# EAGLE design module_adapter (EAGLE 5.12)
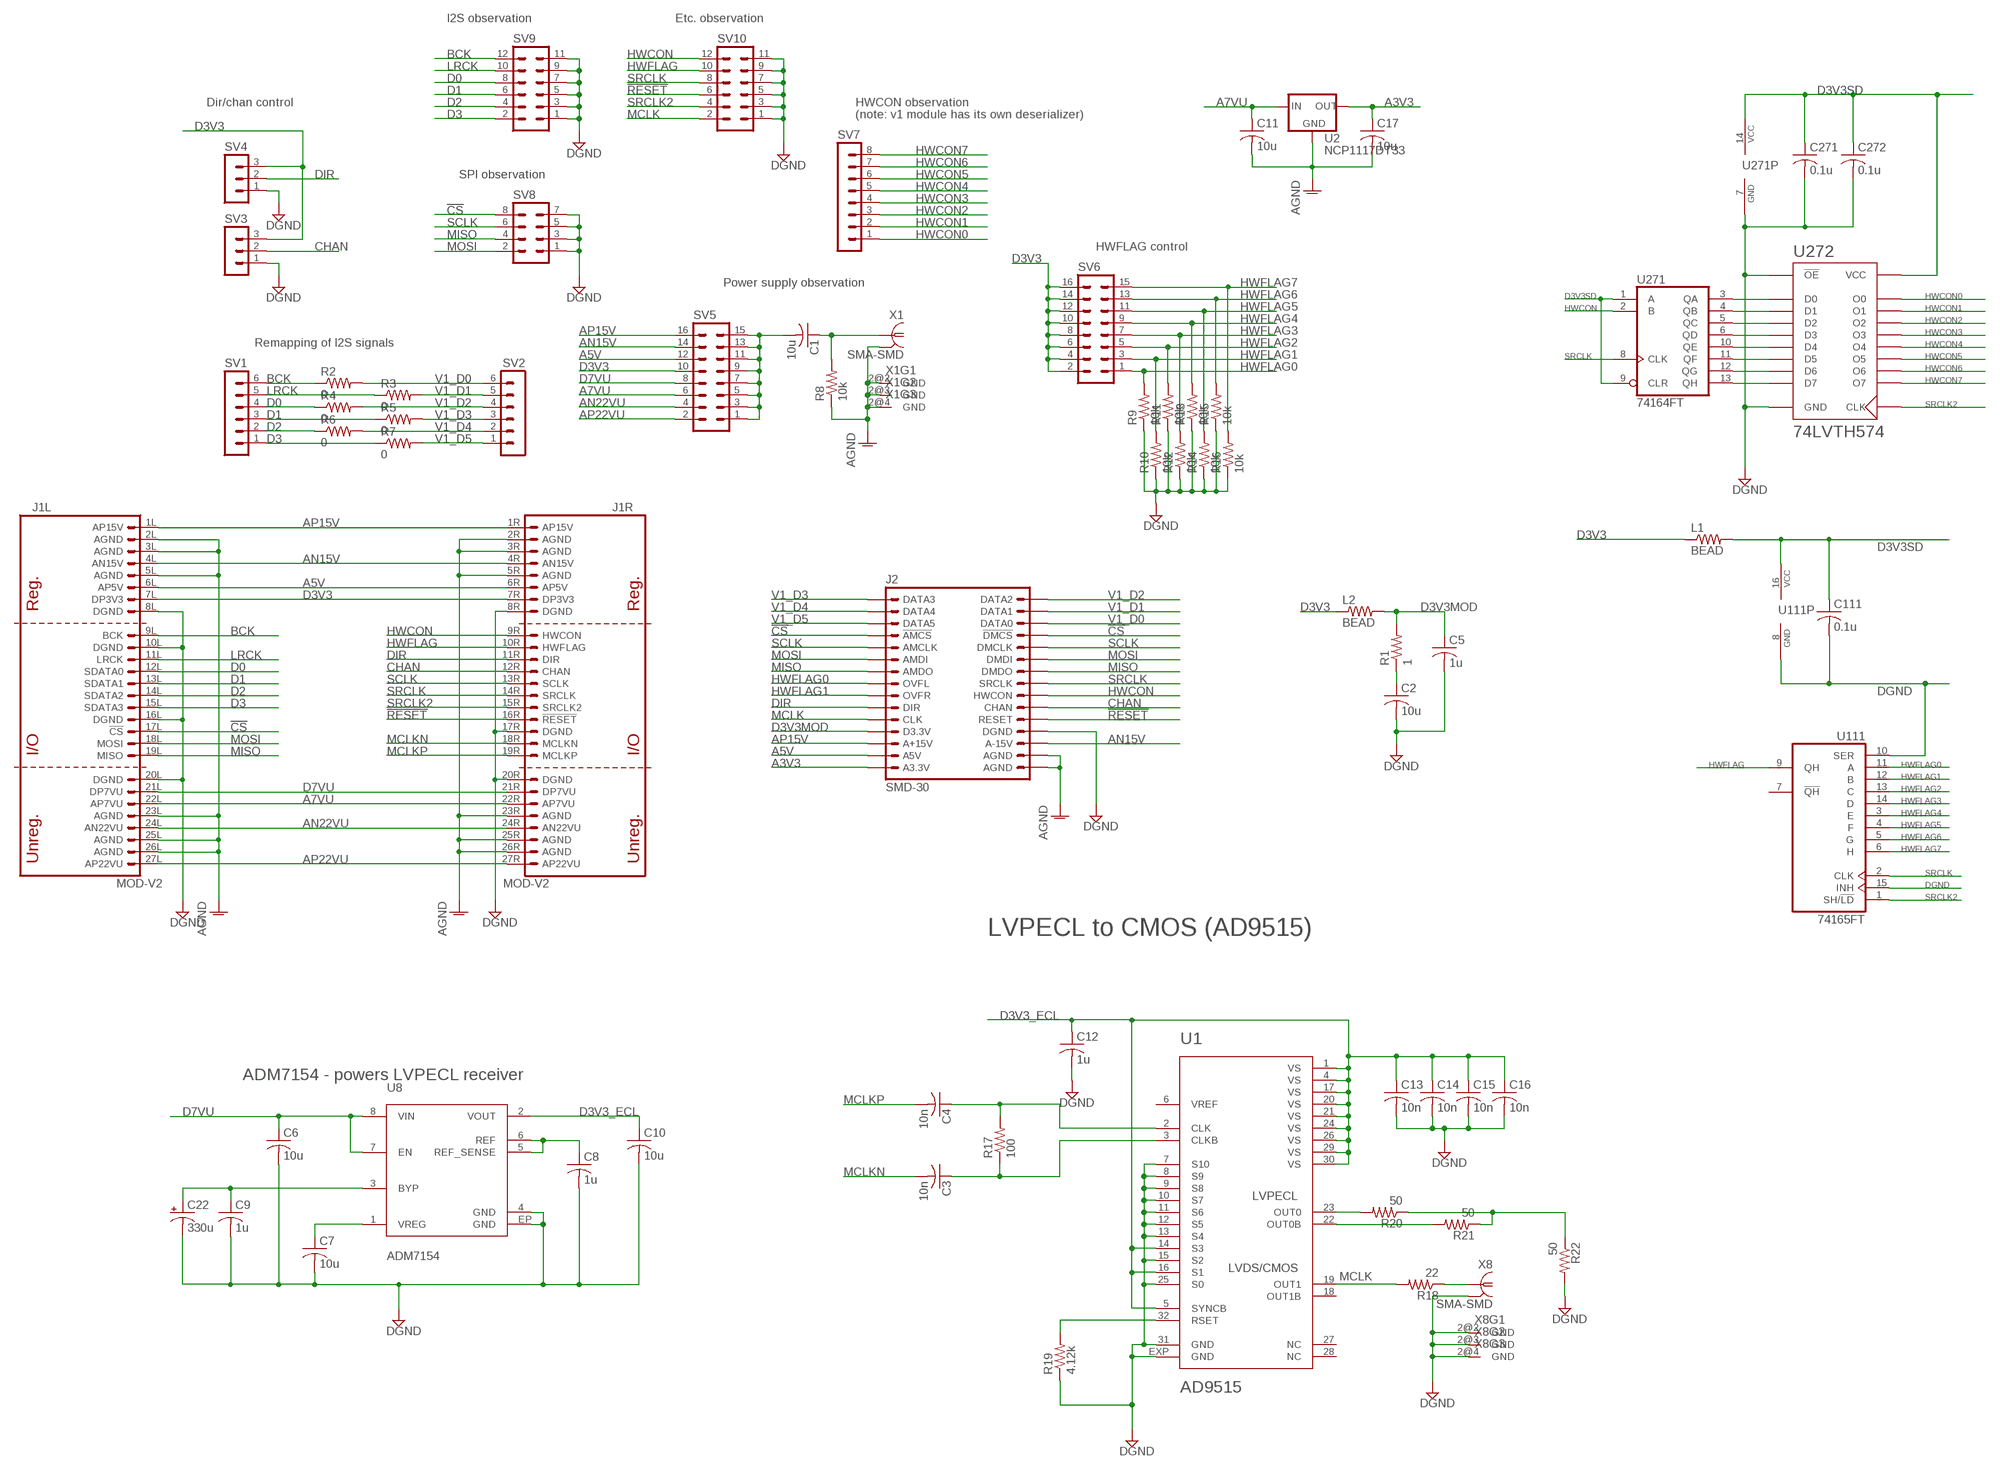
[diagram p0: schematic, sheet 1]

## Parts
C1  10u  C-USC1206  [C1206]
C2  10u  C-USC1206  [C1206]
C3  10n  C-USC0603  [C0603]
C4  10n  C-USC0603  [C0603]
C5  1u  C-USC0603  [C0603]
C6  10u  C-USC1206  [C1206]
C7  10u  C-USC1206  [C1206]
C8  1u  C-USC0805  [C0805]
C9  1u  C-USC0805  [C0805]
C10  10u  C-USC1206  [C1206]
C11  10u  C-USC1206  [C1206]
C12  1u  C-USC0805  [C0805]
C13  10n  C-USC0402  [C0402]
C14  10n  C-USC0402  [C0402]
C15  10n  C-USC0402  [C0402]
C16  10n  C-USC0402  [C0402]
C17  10u  C-USC1206  [C1206]
C22  330u  CPOL-USCT7343  [CT7343]
C111  0.1u  C-USC0603  [C0603]
C271  0.1u  C-USC0603  [C0603]
C272  0.1u  C-USC0603  [C0603]
J1  MOD-V2  [MOD-V2]
J2  SMD-30  [FCI-SMD-30]
L1  BEAD  R-US_R1206  [R1206]
L2  BEAD  R-US_R1206  [R1206]
R1  1  R-US_R0603  [R0603]
R2  0  R-US_R0603  [R0603]
R3  0  R-US_R0603  [R0603]
R4  0  R-US_R0603  [R0603]
R5  0  R-US_R0603  [R0603]
R6  0  R-US_R0603  [R0603]
R7  0  R-US_R0603  [R0603]
R8  10k  R-US_R0603  [R0603]
R9  10k  R-US_R0603  [R0603]
R10  10k  R-US_R0603  [R0603]
R11  10k  R-US_R0603  [R0603]
R12  10k  R-US_R0603  [R0603]
R13  10k  R-US_R0603  [R0603]
R14  10k  R-US_R0603  [R0603]
R15  10k  R-US_R0603  [R0603]
R16  10k  R-US_R0603  [R0603]
R17  100  R-US_R0603  [R0603]
R18  22  R-US_R0603  [R0603]
R19  4.12k  R-US_R0603  [R0603]
R20  50  R-US_R0603  [R0603]
R21  50  R-US_R0603  [R0603]
R22  50  R-US_R0603  [R0603]
SV1  MA06-1  [MA06-1]
SV2  MA06-1  [MA06-1]
SV3  MA03-1  [MA03-1]
SV4  MA03-1  [MA03-1]
SV5  MA08-2  [MA08-2]
SV6  MA08-2  [MA08-2]
SV7  MA08-1  [MA08-1]
SV8  MA04-2  [MA04-2]
SV9  MA06-2  [MA06-2]
SV10  MA06-2  [MA06-2]
U1  AD9515  [LFCSP32]
U2  NCP1117DT33  78XXS  [DPACK]
U8  ADM7154  [SO8-EP]
U111  74165FT  [TSSOP16]
U271  74164FT  [TSSOP14]
U272  74LVTH574  [TSSOP20]
X1  SMA-SMD  [SMA-SMD]
X8  SMA-SMD  [SMA-SMD]

## Nets
!CS: J1.17L(L:!CS) J2.12(!DMCS) J2.19(!AMCS) SV8.8
!RESET: J1.16R(R:!RESET) J2.5(RESET) SV10.6
A3V3: C17.1 J2.30(A3.3V) U2.3(OUT)
A5V: J1.6L(L:AP5V) J1.6R(R:AP5V) J2.29(A5V) SV5.12
A7VU: C11.1 J1.22L(L:AP7VU) J1.22R(R:AP7VU) SV5.6 U2.1(IN)
AGND: C11.2 C17.2 J1.2L(L:AGND) J1.2R(R:AGND) J1.3L(L:AGND) J1.3R(R:AGND) J1.5L(L:AGND) J1.5R(R:AGND) J1.23L(L:AGND) J1.23R(R:AGND) J1.25L(L:AGND) J1.25R(R:AGND) J1.26L(L:AGND) J1.26R(R:AGND) J2.1(AGND) J2.2(AGND) R8.1 U2.4(GND) X1.2@1(GND) X1.2@2(GND) X1.2@3(GND) X1.2@4(GND)
AN15V: J1.4L(L:AN15V) J1.4R(R:AN15V) J2.3(A-15V) SV5.14
AN22VU: J1.24L(L:AN22VU) J1.24R(R:AN22VU) SV5.4
AP15V: J1.1L(L:AP15V) J1.1R(R:AP15V) J2.28(A+15V) SV5.16
AP22VU: J1.27L(L:AP22VU) J1.27R(R:AP22VU) SV5.2
BCK: J1.9L(L:BCK) R2.1 SV1.6 SV9.12
CHAN: J1.12R(R:CHAN) J2.6(CHAN) SV3.2
D0: J1.12L(L:SDATA0) R4.1 SV1.4 SV9.8
D1: J1.13L(L:SDATA1) R5.1 SV1.3 SV9.6
D2: J1.14L(L:SDATA2) R6.1 SV1.2 SV9.4
D3: J1.15L(L:SDATA3) R7.1 SV1.1 SV9.2
D3V3: J1.7L(L:DP3V3) J1.7R(R:DP3V3) L1.1 L2.1 SV3.3 SV4.3 SV5.10 SV6.2 SV6.4 SV6.6 SV6.8 SV6.10 SV6.12 SV6.14 SV6.16
D3V3_ECL: C10.1 C12.1 C13.1 C14.1 C15.1 C16.1 U1.1(VS) U1.4(VS) U1.5(SYNCB) U1.14(S3) U1.16(S1) U1.17(VS) U1.20(VS) U1.21(VS) U1.24(VS) U1.26(VS) U1.29(VS) U1.30(VS) U8.2(VOUT)
D3V3MOD: C5.1 J2.27(D3.3V) L2.2 R1.2
D3V3SD [power]: C111.1 C271.1 C272.1 L1.2 U111.16(VCC) U271.1(A) U271.9(CLR) U271.14(VCC) U272.20(VCC)
D7VU: C6.1 J1.21L(L:DP7VU) J1.21R(R:DP7VU) SV5.8 U8.7(EN) U8.8(VIN)
DGND: C2.2 C5.2 C6.2 C7.2 C8.2 C9.2 C10.2 C12.2 C13.2 C14.2 C15.2 C16.2 C22.- C111.2 C271.2 C272.2 J1.8L(L:DGND) J1.8R(R:DGND) J1.10L(L:DGND) J1.16L(L:DGND) J1.17R(R:DGND) J1.20L(L:DGND) J1.20R(R:DGND) J2.4(DGND) R9.1 R10.1 R11.1 R12.1 R13.1 R14.1 R15.1 R16.1 R19.1 R22.2 SV3.1 SV4.1 SV8.1 SV8.3 SV8.5 SV8.7 SV9.1 SV9.3 SV9.5 SV9.7 SV9.9 SV9.11 SV10.1 SV10.3 SV10.5 SV10.7 SV10.9 SV10.11 U1.7(S10) U1.8(S9) U1.9(S8) U1.10(S7) U1.11(S6) U1.12(S5) U1.13(S4) U1.15(S2) U1.25(S0) U1.31(GND) U1.EXP(GND) U8.4(GND) U8.EP(GND) U111.8(GND) U111.10(SER) U111.15(INH) U271.7(GND) U272.1(!OE) U272.10(GND) X8.2@1(GND) X8.2@2(GND) X8.2@3(GND) X8.2@4(GND)
DIR: J1.11R(R:DIR) J2.25(DIR) SV4.2
HWCON: J1.9R(R:HWCON) J2.7(HWCON) SV10.12 U271.2(B)
HWCON0: SV7.1 U272.19(O0)
HWCON1: SV7.2 U272.18(O1)
HWCON2: SV7.3 U272.17(O2)
HWCON3: SV7.4 U272.16(O3)
HWCON4: SV7.5 U272.15(O4)
HWCON5: SV7.6 U272.14(O5)
HWCON6: SV7.7 U272.13(O6)
HWCON7: SV7.8 U272.12(O7)
HWFLAG: J1.10R(R:HWFLAG) SV10.10 U111.9(QH)
HWFLAG0: J2.23(OVFL) R9.2 SV6.1 U111.11(A)
HWFLAG1: J2.24(OVFR) R10.2 SV6.3 U111.12(B)
HWFLAG2: R11.2 SV6.5 U111.13(C)
HWFLAG3: R12.2 SV6.7 U111.14(D)
HWFLAG4: R13.2 SV6.9 U111.3(E)
HWFLAG5: R14.2 SV6.11 U111.4(F)
HWFLAG6: R15.2 SV6.13 U111.5(G)
HWFLAG7: R16.2 SV6.15 U111.6(H)
LRCK: J1.11L(L:LRCK) R3.1 SV1.5 SV9.10
MCLK: J2.26(CLK) R18.2 SV10.2 U1.19(OUT1)
MCLKN: C3.2 J1.18R(R:MCLKN)
MCLKP: C4.2 J1.19R(R:MCLKP)
MISO: J1.19L(L:MISO) J2.9(DMDO) J2.22(AMDO) SV8.4
MOSI: J1.18L(L:MOSI) J2.10(DMDI) J2.21(AMDI) SV8.2
N$1: C4.1 R17.2 U1.2(CLK)
N$2: U271.4(QB) U272.3(D1)
N$3: U271.5(QC) U272.4(D2)
N$4: U271.10(QE) U272.6(D4)
N$5: U271.11(QF) U272.7(D5)
N$6: U271.12(QG) U272.8(D6)
N$7: U271.13(QH) U272.9(D7)
N$10: C2.1 R1.1
N$11: R20.2 U1.23(OUT0)
N$13: C1.2 SV5.1 SV5.3 SV5.5 SV5.7 SV5.9 SV5.11 SV5.13 SV5.15
N$14: C1.1 R8.2 X1.1
N$15: C3.1 R17.1 U1.3(CLKB)
N$19: C7.1 U8.1(VREG)
N$21: U271.3(QA) U272.2(D0)
N$23: R18.1 X8.1
N$24: U271.6(QD) U272.5(D3)
N$25: R21.2 U1.22(OUT0B)
N$26: C9.1 C22.+ U8.3(BYP)
N$27: R19.2 U1.32(RSET)
N$28: C8.1 U8.5(REF_SENSE) U8.6(REF)
N$29: R20.1 R21.1 R22.1
SCLK: J1.13R(R:SCLK) J2.11(DMCLK) J2.20(AMCLK) SV8.6
SRCLK: J1.14R(R:SRCLK) J2.8(SRCLK) SV10.8 U111.2(CLK) U271.8(CLK)
SRCLK2: J1.15R(R:SRCLK2) SV10.4 U111.1(SH/!LD) U272.11(CLK)
V1_D0: J2.13(DATA0) R2.2 SV2.6
V1_D1: J2.14(DATA1) R3.2 SV2.5
V1_D2: J2.15(DATA2) R4.2 SV2.4
V1_D3: J2.16(DATA3) R5.2 SV2.3
V1_D4: J2.17(DATA4) R6.2 SV2.2
V1_D5: J2.18(DATA5) R7.2 SV2.1
Unconnected: U1.6(VREF) U1.18(OUT1B) U1.27(NC) U1.28(NC) U111.7(!QH)

## Notes on the sheet
- I2S observation | Etc. observation
- Dir/chan control | HWCON observation
- (note: v1 module has its own deserializer)
- SPI observation
- HWFLAG control
- Power supply observation
- Remapping of I2S signals
- LVPECL to CMOS (AD9515)
- ADM7154 - powers LVPECL receiver

## Library data of the parts
C1-C17 C111 C271 C272 = rcl:C-US: CAPACITOR, American symbol
C22 = rcl:CPOL-US: POLARIZED CAPACITOR, American symbol
J1 = cdp:MOD-V2
J2 = cdp:SMD-30
L1 L2 R1-R22 = rcl:R-US_: RESISTOR, American symbol
SV1 SV2 = con-lstb:MA06-1: PIN HEADER; OC_FARNELL: unknown; OC_NEWARK: unknown
SV3 SV4 = con-lstb:MA03-1: PIN HEADER; OC_FARNELL: unknown; OC_NEWARK: unknown
SV5 SV6 = con-lstb:MA08-2: PIN HEADER; OC_FARNELL: unknown; OC_NEWARK: unknown
SV7 = con-lstb:MA08-1: PIN HEADER; OC_FARNELL: unknown; OC_NEWARK: unknown
SV8 = con-lstb:MA04-2: PIN HEADER; OC_FARNELL: unknown; OC_NEWARK: unknown
SV9 SV10 = con-lstb:MA06-2: PIN HEADER; OC_FARNELL: unknown; OC_NEWARK: unknown
U1 = cdp:AD9515
U2 = cdp:78XXS: VOLTAGE REGULATOR
U8 = cdp:ADM7154
U111 = cdp:74*165: 8-bit parallel load SHIFT REGISTER
U271 = cdp:74*164: 8-bit parallel out SHIFT REGISTER
U272 = cdp:74LVTH574
X1 X8 = cdp:SMA-SMD: SMA 50 Ohm Straight Jack Receptacle - Surface Mount www.johnsoncomponents.com Source: http://catalog.digikey.com .. 142-0711-201, 205, 202, 206.pdf; OC_FARNELL: unknown; OC_NEWARK: unknown

## Board
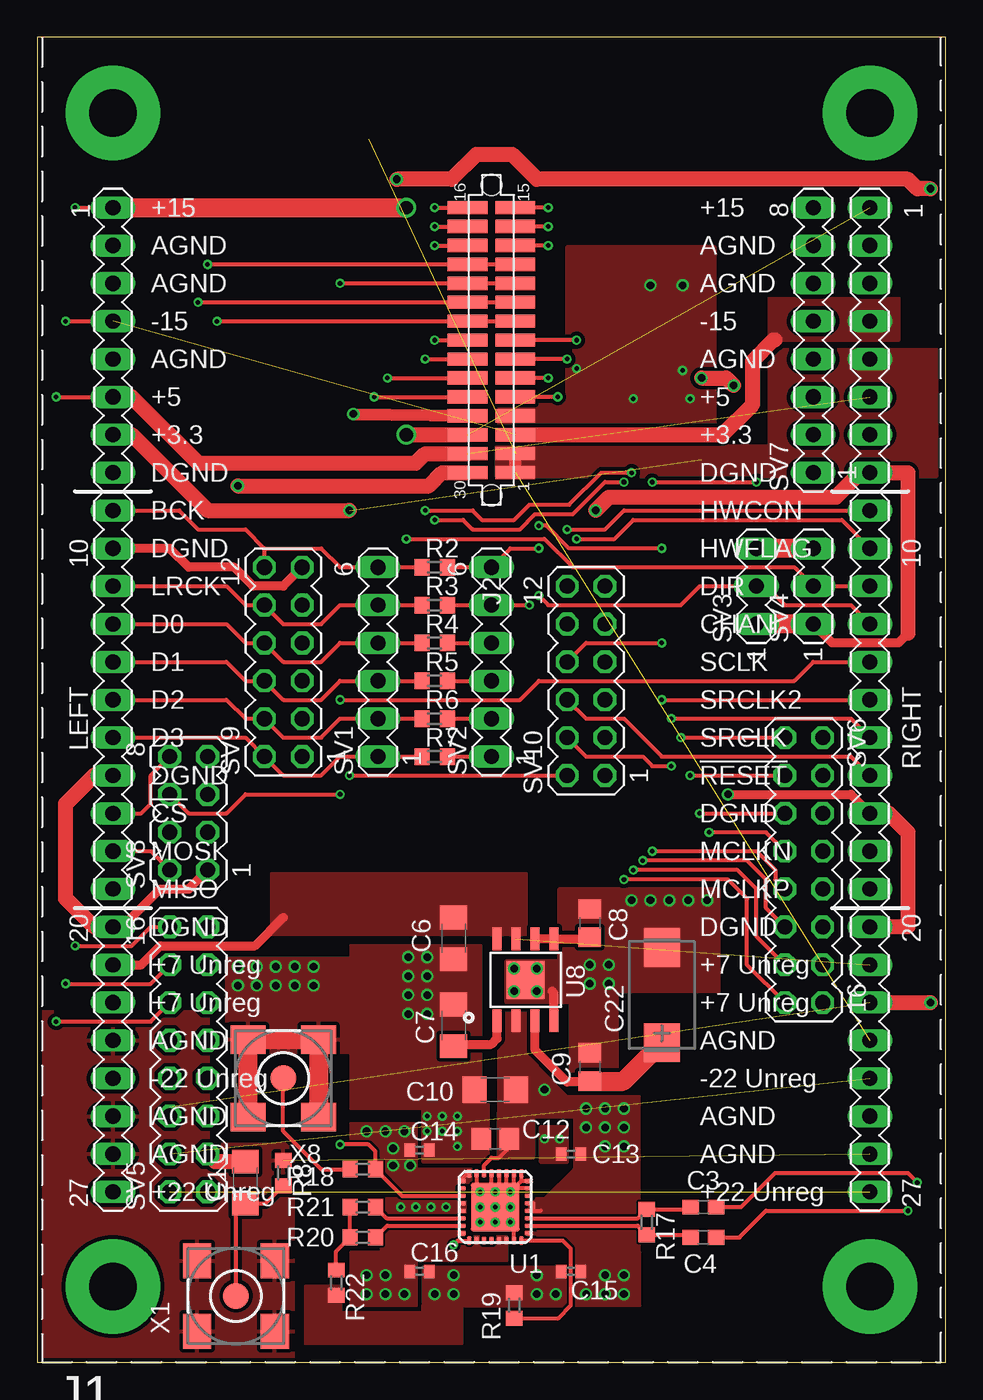
[diagram p1: board, top side]
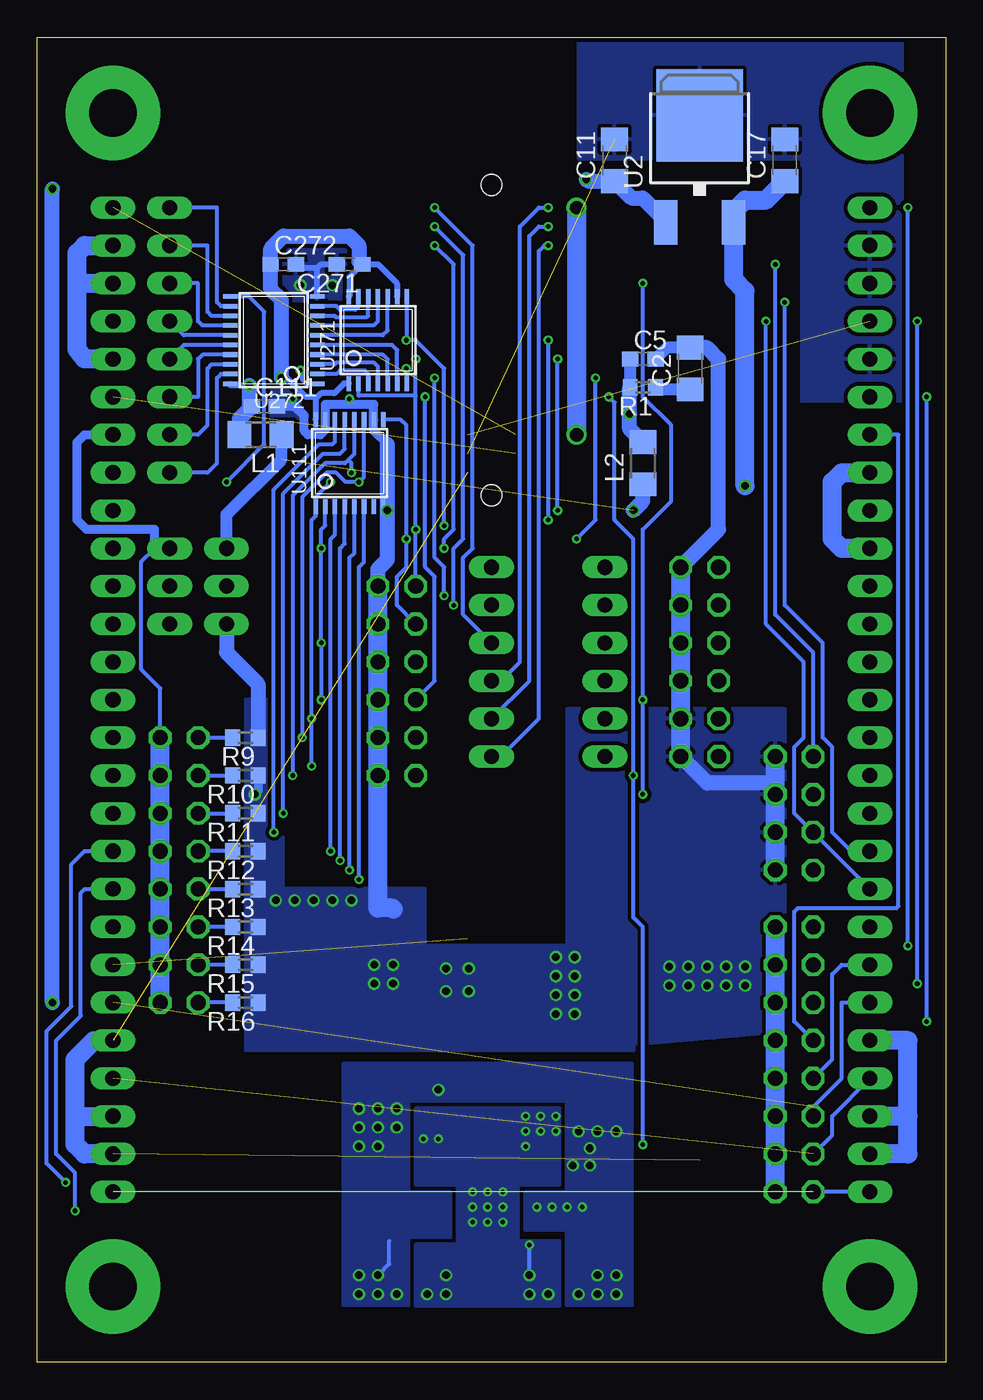
[diagram p2: board, bottom side, seen from below]

Size 60.96 x 88.9 mm. Coordinates in mm from the lower left corner, seen from the top.
Outline: 0,0 60.96,0 60.96,88.9 0,88.9 0,0
Copper layers (1*16): Top 0.035mm / dielectric 1.6mm / Bottom 0.035mm
Design rules "Elecrow_2-layer_PCB_eagle_rule_mod": minimum track width 6mil, minimum drill 12mil, track to track 6mil, track to pad 6mil, pad to pad 6mil, via to via 8mil, smd to smd 0mil, copper to edge 12mil, drill to drill 10mil, minimum pad ring 6mil, minimum via ring 6mil, stop-mask expansion 0mil, vias tented up to drill 100mil, thermal gap 10mil

### Footprints (pad centres in the part's own frame; a part is rotated, then mirrored left to right if it is on the bottom)
C1206 = smd 1.6 x 1.8: 1 -1.4,0; 2 1.4,0
C0603 = smd 1.1 x 1: 1 -0.85,0; 2 0.85,0
C0805 = smd 1.3 x 1.5: 1 -0.95,0; 2 0.95,0
C0402 = smd 0.7 x 0.9: 1 -0.65,0; 2 0.65,0
CT7343 = smd 2.6 x 2.4: + -3.2,0; - 3.2,0
MOD-V2 = drill 1.016 long: 1L -25.4,33.02; 1R 25.4,33.02; 2L -25.4,30.48; 2R 25.4,30.48; 3L -25.4,27.94; 3R 25.4,27.94; 4L -25.4,25.4; 4R 25.4,25.4; 5L -25.4,22.86; 5R 25.4,22.86; 6L -25.4,20.32; 6R 25.4,20.32; 7L -25.4,17.78; 7R 25.4,17.78; 8L -25.4,15.24; 8R 25.4,15.24; 9L -25.4,12.7; 9R 25.4,12.7; 10L -25.4,10.16; 10R 25.4,10.16; 11L -25.4,7.62; 11R 25.4,7.62; 12L -25.4,5.08; 12R 25.4,5.08; 13L -25.4,2.54; 13R 25.4,2.54; 14L -25.4,0; 14R 25.4,0; 15L -25.4,-2.54; 15R 25.4,-2.54; 16L -25.4,-5.08; 16R 25.4,-5.08; 17L -25.4,-7.62; 17R 25.4,-7.62; 18L -25.4,-10.16; 18R 25.4,-10.16; 19L -25.4,-12.7; 19R 25.4,-12.7; 20L -25.4,-15.24; 20R 25.4,-15.24; 21L -25.4,-17.78; 21R 25.4,-17.78; 22L -25.4,-20.32; 22R 25.4,-20.32; 23L -25.4,-22.86; 23R 25.4,-22.86; 24L -25.4,-25.4; 24R 25.4,-25.4; 25L -25.4,-27.94; 25R 25.4,-27.94; 26L -25.4,-30.48; 26R 25.4,-30.48; 27L -25.4,-33.02; 27R 25.4,-33.02 | drill 3.175 pad 6.35 round: DP1 -25.4,39.37; DP2 25.4,39.37; DP3 -25.4,-39.37; DP4 25.4,-39.37
FCI-SMD-30 = smd 0.889 x 2.667: 1 -8.89,-1.6; 2 -7.62,-1.6; 3 -6.35,-1.6; 4 -5.08,-1.6; 5 -3.81,-1.6; 6 -2.54,-1.6; 7 -1.27,-1.6; 8 0,-1.6; 9 1.27,-1.6; 10 2.54,-1.6; 11 3.81,-1.6; 12 5.08,-1.6; 13 6.35,-1.6; 14 7.62,-1.6; 15 8.89,-1.6; 16 8.89,1.6; 17 7.62,1.6; 18 6.35,1.6; 19 5.08,1.6; 20 3.81,1.6; 21 2.54,1.6; 22 1.27,1.6; 23 0,1.6; 24 -1.27,1.6; 25 -2.54,1.6; 26 -3.81,1.6; 27 -5.08,1.6; 28 -6.35,1.6; 29 -7.62,1.6; 30 -8.89,1.6 | hole 1.4: -10.414,0; 10.414,0
R1206 = smd 1.6 x 1.803: 1 -1.422,0; 2 1.422,0
R0603 = smd 1 x 1.1: 1 -0.85,0; 2 0.85,0
MA06-1 = drill 1.016 long: 1 -6.35,0; 2 -3.81,0; 3 -1.27,0; 4 1.27,0; 5 3.81,0; 6 6.35,0
MA03-1 = drill 1.016 long: 1 -2.54,0; 2 0,0; 3 2.54,0
MA08-2 = drill 1.016 octagon: 1 -8.89,-1.27; 2 -8.89,1.27; 3 -6.35,-1.27; 4 -6.35,1.27; 5 -3.81,-1.27; 6 -3.81,1.27; 7 -1.27,-1.27; 8 -1.27,1.27; 9 1.27,-1.27; 10 1.27,1.27; 11 3.81,-1.27; 12 3.81,1.27; 13 6.35,-1.27; 14 6.35,1.27; 15 8.89,-1.27; 16 8.89,1.27
MA08-1 = drill 1.016 long: 1 -8.89,0; 2 -6.35,0; 3 -3.81,0; 4 -1.27,0; 5 1.27,0; 6 3.81,0; 7 6.35,0; 8 8.89,0
MA04-2 = drill 1.016 octagon: 1 -3.81,-1.27; 2 -3.81,1.27; 3 -1.27,-1.27; 4 -1.27,1.27; 5 1.27,-1.27; 6 1.27,1.27; 7 3.81,-1.27; 8 3.81,1.27
MA06-2 = drill 1.016 octagon: 1 -6.35,-1.27; 2 -6.35,1.27; 3 -3.81,-1.27; 4 -3.81,1.27; 5 -1.27,-1.27; 6 -1.27,1.27; 7 1.27,-1.27; 8 1.27,1.27; 9 3.81,-1.27; 10 3.81,1.27; 11 6.35,-1.27; 12 6.35,1.27
LFCSP32 = smd 0.55 x 0.3: 1 -2.25,1.75; 2 -2.25,1.25; 3 -2.25,0.75; 4 -2.25,0.25; 5 -2.25,-0.25; 6 -2.25,-0.75; 7 -2.25,-1.25; 8 -2.25,-1.75; 17 2.25,-1.75; 18 2.25,-1.25; 19 2.25,-0.75; 20 2.25,-0.25; 21 2.25,0.25; 22 2.25,0.75; 23 2.25,1.25; 24 2.25,1.75 | smd 0.3 x 0.55: 9 -1.75,-2.25; 10 -1.25,-2.25; 11 -0.75,-2.25; 12 -0.25,-2.25; 13 0.25,-2.25; 14 0.75,-2.25; 15 1.25,-2.25; 16 1.75,-2.25; 25 1.75,2.25; 26 1.25,2.25; 27 0.75,2.25; 28 0.25,2.25; 29 -0.25,2.25; 30 -0.75,2.25; 31 -1.25,2.25; 32 -1.75,2.25 | smd 3.25 x 3.25: EXP 0,0
DPACK = smd 1.6 x 3: 1 -2.28,-4.8; 3 2.28,-4.8 | smd 5.8 x 6.2: 4 0,2.38
SO8-EP = smd 0.61 x 1.524: 1 -1.905,-2.743; 2 -0.635,-2.743; 3 0.635,-2.743; 4 1.905,-2.743; 5 1.905,2.743; 6 0.635,2.743; 7 -0.635,2.743; 8 -1.905,2.743 | smd 2.54 x 2.54: EP 0,0
TSSOP16 = smd 0.305 x 0.991: 1 -2.275,-2.918; 2 -1.625,-2.918; 3 -0.975,-2.918; 4 -0.325,-2.918; 5 0.325,-2.918; 6 0.975,-2.918; 7 1.625,-2.918; 8 2.275,-2.918; 9 2.275,2.918; 10 1.625,2.918; 11 0.975,2.918; 12 0.325,2.918; 13 -0.325,2.918; 14 -0.975,2.918; 15 -1.625,2.918; 16 -2.275,2.918
TSSOP14 = smd 0.305 x 0.991: 1 -1.95,-2.918; 2 -1.3,-2.918; 3 -0.65,-2.918; 4 0,-2.918; 5 0.65,-2.918; 6 1.3,-2.918; 7 1.95,-2.918; 8 1.95,2.918; 9 1.3,2.918; 10 0.65,2.918; 11 0,2.918; 12 -0.65,2.918; 13 -1.3,2.918; 14 -1.95,2.918
TSSOP20 = smd 0.305 x 0.991: 1 -2.925,-2.918; 2 -2.275,-2.918; 3 -1.625,-2.918; 4 -0.975,-2.918; 5 -0.325,-2.918; 6 0.325,-2.918; 7 0.975,-2.918; 8 1.625,-2.918; 9 2.275,-2.918; 10 2.925,-2.918; 11 2.925,2.918; 12 2.275,2.918; 13 1.625,2.918; 14 0.975,2.918; 15 0.325,2.918; 16 -0.325,2.918; 17 -0.975,2.918; 18 -1.625,2.918; 19 -2.275,2.918; 20 -2.925,2.918
SMA-SMD = smd 1.73 x 1.73: 1 0,0 | smd 2.35 x 1.9: 2@1 -2.375,2.6; 2@2 -2.375,-2.6; 2@3 2.375,-2.6; 2@4 2.375,2.6

### Placement (x,y rotation side)
C1  13.97,12.06 90 top
C2  17.14,66.67 90 bottom
C3  44.7,10.41 0 top
C4  44.7,8.38 0 top
C5  20.32,67.31 0 bottom
C6  27.94,28.45 270 top
C7  27.94,22.61 90 top
C8  37.08,29.46 90 top
C9  37.08,19.81 90 top
C10  30.73,18.29 180 top
C11  22.23,80.64 90 bottom
C12  30.73,14.99 180 top
C13  35.81,13.97 180 top
C14  25.65,14.22 0 top
C15  35.81,6.1 180 top
C16  25.65,6.1 0 top
C17  10.79,80.64 90 bottom
C22  41.91,24.64 90 top
C111  45.72,64.14 0 bottom
C271  40.01,73.66 180 bottom
C272  44.45,73.66 0 bottom
J1  30.48,44.45 0 top
J2  30.48,68.58 90 top
L1  45.97,62.23 180 bottom
L2  20.32,60.33 90 bottom
R1  20.32,65.41 180 bottom
R2  26.67,53.34 0 top
R3  26.67,50.8 0 top
R4  26.67,48.26 0 top
R5  26.67,45.72 0 top
R6  26.67,43.18 0 top
R7  26.67,40.64 0 top
R8  16.51,12.7 270 top
R9  46.99,41.91 180 bottom
R10  46.99,39.37 180 bottom
R11  46.99,36.83 180 bottom
R12  46.99,34.29 180 bottom
R13  46.99,31.75 180 bottom
R14  46.99,29.21 180 bottom
R15  46.99,26.67 180 bottom
R16  46.99,24.13 180 bottom
R17  40.89,9.4 270 top
R18  21.84,12.95 0 top
R19  32,3.81 270 top
R20  21.84,8.38 0 top
R21  21.84,10.41 0 top
R22  20.07,5.33 270 top
SV1  22.86,46.99 90 top
SV2  30.48,46.99 90 top
SV3  48.26,52.07 90 top
SV4  52.07,52.07 90 top
SV5  10.16,20.32 90 top
SV6  51.44,33.02 270 top
SV7  52.07,68.58 90 top
SV8  10.16,36.83 90 top
SV9  16.51,46.99 90 top
SV10  36.83,45.72 90 top
U1  30.73,10.41 180 top
U2  16.51,81.28 0 bottom
U8  32.77,25.65 0 top
U111  40.01,60.33 0 bottom
U271  38.1,68.58 0 bottom
U272  45.09,68.58 90 bottom
X1  13.34,4.45 90 top
X8  16.51,19.05 180 top

### Tracks (layer width: path | path; a pad name or v marks a point on that pad's centre or on a via)
!CS  (via drill 0.3 pad 0.51)
  Top 0.254: J2.12 J2.19 v11.43,73.66 | J1.17L 6.99,36.83 7.62,37.47 7.62,39.37 SV8.8
  Bottom 0.254: SV8.8 8.89,47.62 11.43,50.16 v11.43,73.66
!RESET  (via drill 0.3 pad 0.51)
  Top 0.254: v34.92,64.77 J2.5 | J1.16R 54.61,40.64 41.91,40.64 39.37,43.18 36.83,43.18 SV10.6
  Bottom 0.254: v34.92,64.77 34.92,53.34 34.29,52.7 34.29,45.72 SV10.6
A3V3  (via drill 0.51 pad 0.81)
  Top 1.016: v13.46,58.8 26.29,58.8 27.18,59.69 J2.30
  Bottom 1.27: C17.1 12.06,77.98 13.46,77.98 14.23,77.21 U2.3 14.22,72.64 13.46,71.88 v13.46,58.8
A5V  (via drill 0.3 pad 0.51)  (1 unrouted)
  Top 0.254: v1.27,64.77 J1.6L | v1.27,22.86 7.62,22.86 SV5.12
  Top 1.016: J1.6L 6.35,64.77 10.79,60.33 25.4,60.33 26.04,60.96 J2.29
  Bottom 0.254: v1.27,22.86 v1.27,64.77
A7VU  (via drill 0.51 pad 0.81)  (1 unrouted)
  Top 1.016: J1.22R v59.94,24.13 | v24.13,79.38 27.81,79.38 29.46,81.03 31.88,81.03 33.53,79.38 58.42,79.38 59.05,78.74 v59.94,78.74
  Bottom 0.254: SV5.6 8.89,17.14 6.99,19.05 6.99,24.13 J1.22L
  Bottom 1.016: v59.94,24.13 v59.94,78.74 | v24.13,79.38 24,79.25 C11.1 21.09,78.11 20.32,78.11 18.79,76.58 U2.1
AGND  (3 unrouted)
  Top 0.813: J2.1 J2.2
  Bottom 1.27: J1.23L 2.54,21.59 2.54,16.51 | 2.54,16.51 2.54,13.97 J1.26L | 2.54,16.51 J1.25L | J1.23R 57.15,21.59 58.42,20.32 58.42,16.51 | 58.42,16.51 58.42,14.61 57.78,13.97 J1.26R | 58.42,16.51 J1.25R | J1.2R 57.78,74.93 58.29,74.42 58.29,72.39 | 58.29,72.39 58.29,67.94 57.78,67.31 J1.5R | 58.29,72.39 J1.3R
  pour Top (isolate 0.254, no thermals): 49.15,61.47 49.15,67.56 49.53,67.94 60.33,67.94 60.33,59.44 30.86,59.44 30.86,61.47
  pour Top (isolate 0.254): 0,23.5 11.43,23.5 11.43,14.61 17.14,14.61 17.14,0 0,0
  pour Bottom (isolate 0.254): 24.64,80.77 9.65,80.77 9.65,64.52 2.92,64.52 2.92,88.52 24.64,88.52
AN15V  (via drill 0.3 pad 0.51)  (1 unrouted)
  Top 0.254: v1.91,69.85 J1.4L | v1.91,25.4 7.62,25.4 SV5.14
  Top 1.016: J2.3 45.97,62.23 48.01,64.26 48.01,67.18 49.4,68.58 49.53,68.58
  Bottom 0.254: v1.91,25.4 v1.91,69.85
  pour Top (isolate 0.254, no thermals): 49.15,71.37 57.78,71.37 57.78,68.58 49.15,68.58
AN22VU  (1 unrouted)
  Bottom 0.254: SV5.4 7.62,15.24 7.62,16.51 J1.24L
AP15V  (via drill 0.3 pad 0.51, 0.89 pad 1.27)  (1 unrouted)
  Top 0.254: v2.54,77.47 J1.1L | v2.54,27.94 6.35,27.94 7.62,29.21 SV5.16
  Top 1.016: v24.77,62.23 J2.28
  Top 1.27: J1.1L v24.77,77.47
  Bottom 0.254: v2.54,27.94 v2.54,77.47
  Bottom 1.27: v24.77,77.47 v24.77,62.23
AP22VU  (1 unrouted)
  Bottom 0.254: J1.27L SV5.2
BCK
  Top 0.254: J1.9L 9.53,57.15 10.79,55.88 13.97,55.88 15.24,54.61 | 15.24,54.61 19.05,54.61 20.32,53.34 SV1.6 R2.1 | 15.24,54.61 SV9.12
CHAN  (via drill 0.3 pad 0.51)
  Top 0.254: J1.12R 54.61,50.8 50.16,50.8 48.9,52.07 SV3.2 44.45,52.07 43.18,50.8 34.29,50.8 v33.66,51.44 | v34.29,66.04 J2.6
  Bottom 0.254: v33.66,51.44 33.66,53.34 34.29,53.98 v34.29,66.04
D0
  Top 0.254: J1.12L 12.7,49.53 13.97,48.26 SV9.8 16.51,46.99 19.05,46.99 20.32,48.26 SV1.4 R4.1
D1
  Top 0.254: J1.13L 12.7,46.99 13.97,45.72 SV9.6 16.51,44.45 19.05,44.45 20.32,45.72 SV1.3 R5.1
D2
  Top 0.254: J1.14L 12.7,44.45 13.97,43.18 SV9.4 16.51,41.91 19.05,41.91 20.32,43.18 SV1.2 R6.1
D3
  Top 0.254: R7.1 SV1.1 20.32,40.64 19.05,39.37 16.51,39.37 SV9.2 13.97,41.91 6.35,41.91 J1.15L
D3V3  (via drill 0.51 pad 0.81)  (1 unrouted)
  Top 1.016: J1.7L 6.35,62.23 11.43,57.15 v20.95,57.15
  Top 1.27: SV4.3 SV3.3
  Bottom 0.254: SV4.3 53.09,54.61 53.98,53.72 53.98,46.48 52.7,45.21 SV6.2 | SV5.10 10.16,22.86 10.16,30.23 9.91,30.48 3.3,30.48 3.17,30.61 3.17,62.23 J1.7L
  Bottom 0.61: 53.09,54.61 53.09,55.88 57.66,55.88 58.29,56.52 58.29,61.72 57.78,62.23 J1.7R
  Bottom 0.813: L1.1 44.58,62.2 44.58,60.58 48.26,56.9 SV3.3
  Bottom 1.016: v20.95,57.15 20.32,57.78 L2.1
  Bottom 1.27: SV6.2 SV6.4 SV6.6 SV6.8 SV6.10 SV6.12 SV6.14 SV6.16
D3V3_ECL  (via drill 0.3 pad 0.51, 0.51 pad 0.81)
  Top 0.254: 33.27,10.16 U1.4 | 33.27,10.16 33.78,10.16 | U1.5 33.28,10.66 33.27,10.16 | 29.98,12.71 U1.14 29.98,13.22 30.48,13.72 30.99,13.72 31.5,14.22 31.5,14.8 C12.1 | U1.17 28.48,12.23 | 28.48,12.23 28.96,12.7 | 28.48,12.23 28.45,12.19
  Bottom 0.254: 37.34,8.13 37.34,6.6 v38.1,5.84
  other vias: 36.83,4.57 38.1,4.57 39.37,4.57 39.37,5.84 24.64,4.57 23.37,4.57 22.1,4.57 22.1,5.84 23.37,5.84 38.1,14.48 39.37,14.48 39.37,15.75 38.1,15.75 36.83,15.75 23.88,13.21 22.1,15.49 23.37,15.49 24.64,15.49 34.04,18.29 36.83,17.02 38.1,17.02 39.37,17.02 27.43,10.41 26.42,10.41 25.4,10.41 24.38,10.41 25.02,13.21 23.88,14.35
  pour Top (isolate 0.254, no thermals): 33.53,23.37 30.99,23.37 30.99,16.51 36.07,16.51 36.07,13.46 40.39,13.46 40.39,17.78 35.56,17.78 33.53,19.81
  pour Bottom: 40.39,20.07 21.08,20.07 21.08,3.81 25.4,3.81 25.4,8.89 28.19,8.89 28.19,11.43 25.4,11.43 25.4,17.53 36.07,17.53 36.07,11.43 33.27,11.43 33.27,8.38 36.07,8.38 36.07,3.81 40.39,3.81
  pour Top (no thermals): 33.27,13.72 30.99,13.72 30.99,16.76 33.27,16.76
  pour Top (no thermals): 25.4,3.81 21.08,3.81 21.08,7.37 25.4,7.37
  pour Top (no thermals): 25.4,13.46 21.08,13.46 21.08,16 25.4,16
  pour Top (no thermals): 40.39,3.81 36.07,3.81 36.07,7.37 40.39,7.37
  pour Top: 33.02,8.89 33.02,7.62 36.32,7.62 36.32,6.35 40.39,6.35 40.39,8.89
  pour Top (no thermals): 33.02,10.92 33.02,9.91 40.39,9.91 40.39,13.46 36.07,13.46 36.07,12.95 34.04,10.92
  pour Top (no thermals): 29.21,12.95 29.21,11.43 24.38,11.43 23.37,12.45 23.37,13.72 25.4,13.72 25.4,12.95
  pour Top (no thermals): 28.7,9.91 28.7,10.92 23.37,10.92 23.37,9.65 28.45,9.65
  pour Top (no thermals): 31.5,6.86 31.5,8.38 28.96,8.38 28.45,8.89 23.11,8.89 23.11,7.37 25.4,6.86
D3V3MOD  (via drill 0.51 pad 0.81)
  Top 0.813: v21.21,63.63 J2.27
  Bottom 0.813: R1.2 C5.1
  Bottom 1.016: R1.2 21.21,65.37 v21.21,63.63 21.21,62.64 L2.2
D3V3SD  (via drill 0.51 pad 0.81)
  Top 1.016: v44.58,66.04 46.23,66.04 v46.74,65.53
  Bottom 0.254: 42.29,63.25 U111.16
  Bottom 0.406: U271.9 36.83,71.53 36.83,72.39 38.1,73.66 C271.1 40.01,72.81 40.01,71.54 U271.14 | U271.1 40.38,65.66 41.02,65.02 41.91,65.02 42.29,64.64 | 42.29,64.64 42.29,63.25 | v44.58,66.04 44.2,66.04 42.93,64.77 42.42,64.77 42.29,64.64 | v46.74,65.53 47.97,65.53 48,65.57 U272.20
  Bottom 1.016: C271.1 39.37,73.88 39.37,74.93 40.01,75.56 44.45,75.56 45.3,74.72 C272.1 45.3,71.97 44.58,71.25 v44.58,66.04 | L1.2 47.4,63.31 C111.1 46.74,64.3 v46.74,65.53
D7VU  (1 unrouted)
  Top 0.61: J1.21L 6.99,26.67 8.26,27.94 14.61,27.94 16.51,29.84
  Bottom 0.254: SV5.8 7.62,20.32 7.62,26.04 6.99,26.67 J1.21L
  pour Top (isolate 0.254, no thermals): 32.77,28.7 15.75,28.7 15.75,32.77 32.77,32.77
DGND  (via drill 0.3 pad 0.51, 0.51 pad 0.51, 0.51 pad 0.81)
  Top 0.254: v30.73,9.4 U1.EXP | U1.31 31.98,9.16 v31.75,9.4 | U1.15 29.48,11.66 v29.72,11.43 | U1.7 31.98,11.66 | U1.13 30.48,11.68 v30.73,11.43 30.98,11.68 U1.12 | U1.11 31.48,11.7 v31.75,11.43 | 31.98,11.66 U1.10 | 31.98,11.66 v31.75,11.43 | 32.48,12.16 U1.9 | v31.75,11.43 32.48,12.16 | 32.48,12.16 U1.8 | v29.72,9.4 29.72,9.27 | U1.25 28.23,8.16 v27.94,7.87
  Top 0.61: U8.4 34.67,24.77 34.54,24.89 | SV8.1 10.16,31.75 8.26,31.75 5.71,29.21 J1.20L | J1.10L 8.89,54.61 10.16,53.34 13.21,53.34 14.48,52.07 16.51,52.07 SV9.11 | J1.17R 54.61,38.1 v46.35,38.1 | 58.42,48.9 57.78,48.26 53.34,48.26 SV4.1
  Top 1.016: J1.17R 57.15,36.83 58.42,35.56 58.42,29.21 J1.20R | 58.42,48.9 58.42,59.69 J1.8R 55.24,59.69 53.59,58.04 38.35,58.04 v37.47,57.15 | J1.16L 3.81,39.37 1.91,37.47 1.91,31.11 3.81,29.21 J1.20L
  Top 1.27: X8.2@1 X8.2@2 X8.2@3 X8.2@4 | SV4.1 SV3.1
  Bottom 0.254: v27.94,5.84 v27.94,7.87 | U272.1 42.92,65.66 43.18,65.91 43.18,66.42 v43.31,66.55 | U271.7 36.15,66.63 v36.2,66.67
  Bottom 0.406: U272.10 42.17,73.4 | 42.17,73.4 41.91,73.66 C271.2 | 42.17,73.4 43.34,73.4 C272.2 | U111.8 37.47,56.4 37.47,56.52
  Bottom 0.61: 40.01,64.26 38.38,64.26 U111.10 38.38,62.51 37.47,61.59 | 40.01,64.26 41.63,64.26 U111.15 41.63,62.56 41.96,62.23 42.8,62.23 43.05,62.48 43.05,63.5 43.69,64.14 C111.2 | v46.35,38.1 46.14,38.31 R10.1 | 40.01,64.26 v40.01,64.64
  Bottom 0.813: C5.2 18.7,68.08 C2.2
  Bottom 1.016: SV9.1 16,38.86 11.43,38.86 | SV9.11 15.24,55.88 15.24,67.31 16,68.08 C2.2 | SV3.1 48.26,47.62 46.14,45.51 R9.1 | SV10.11 38.1,53.21 37.47,53.85 37.47,56.52 v37.47,57.15 37.47,61.59
  Bottom 1.27: SV10.11 SV10.9 SV10.7 SV10.5 SV10.3 SV10.1 38.1,30.48 37.15,30.48 C8.2 | SV8.7 11.43,38.86 SV8.5 SV8.3 SV8.1 | SV9.11 SV9.9 SV9.7 SV9.5 SV9.3 SV9.1 | J1.8L 6.99,59.69 7.62,59.05 7.62,55.24 6.99,54.61 J1.10L
  other vias: 33.53,26.42 33.53,24.89 32,26.42 32,24.89 26.16,27.18 26.16,25.91 26.16,24.64 26.16,23.37 24.89,27.18 24.89,25.91 24.89,24.64 24.89,23.37 38.35,26.67 38.35,25.4 37.08,26.67 37.08,25.4 44.96,30.99 43.69,30.99 42.42,30.99 41.15,30.99 39.88,30.99 31.75,10.41 30.73,10.41 29.72,10.41 34.8,4.57 33.53,4.57 33.53,5.84 26.67,4.57 27.94,4.57 35.05,14.99 34.04,14.99 28.19,15.49 28.19,14.48 27.18,15.49 26.16,15.49 26.16,16.51 27.18,16.51 28.19,16.51 16,26.54 17.27,26.54 18.54,26.54 18.54,25.27 17.27,25.27 16,25.27 14.73,25.27 13.46,25.27 13.46,26.54 14.73,26.54 41.15,72.26 43.31,72.26 43.81,64.64
  pour Top (isolate 0.254, no thermals): 45.72,31.75 45.72,24.89 38.86,24.89 38.86,19.56 35.81,19.56 35.81,24.13 31.5,24.13 31.5,26.92 35.05,26.92 35.05,31.75
  pour Top (isolate 0.254, no thermals): 29.72,27.94 29.72,17.02 21.08,17.02 21.08,27.94
  pour Bottom: 35.56,3.81 25.91,3.81 25.91,8.13 28.7,8.13 28.7,11.94 25.91,11.94 25.91,17.02 35.56,17.02 35.56,11.94 32.77,11.94 32.77,7.87 35.56,7.87
  pour Top (no thermals): 35.56,6.35 25.91,6.35 25.91,3.81 35.56,3.81
  pour Top (no thermals): 25.91,13.46 25.91,17.27 30.23,17.27 30.23,13.46
  pour Top (no thermals): 35.56,13.46 35.56,15.75 33.78,15.75 33.78,13.46
  pour Top: 24.64,27.05 12.7,27.05 12.7,20.83 24.64,20.83
  pour Top (no thermals): 28.45,3.81 28.45,1.27 18.03,1.27 18.03,5.08 20.32,5.08 20.32,3.3 25.91,3.3 25.91,3.81
  pour Bottom (isolate 0.254, no thermals): 46.99,44.45 46.99,20.95 20.95,20.95 20.95,27.94 34.92,27.94 34.92,31.75 44.45,31.75 44.45,44.45
  pour Bottom (isolate 0.254): 10.79,43.81 25.4,43.81 25.4,20.95 10.79,22.23
  pour Top (isolate 0.254, no thermals): 30.99,62.99 45.47,62.99 45.47,74.8 35.56,74.8 35.56,64.39 30.99,64.39
  pour Bottom (isolate 0.254): 40.26,74.68 44.45,74.68 44.45,71.25 40.26,71.25
  pour Bottom (isolate 0.254, no thermals): 43.31,65.15 45.34,65.15 45.34,63.37 43.31,63.37
DIR  (via drill 0.3 pad 0.51)
  Top 0.254: J1.11R SV4.2 50.8,53.34 35.94,53.34 34.04,55.24 v24.77,55.24 | v23.5,66.04 J2.25
  Bottom 0.254: v23.5,66.04 23.5,56.52 v24.77,55.24
HWCON  (via drill 0.3 pad 0.51)
  Top 0.254: v35.56,67.31 J2.7 | v35.56,55.88 38.1,55.88 39.37,57.15 J1.9R
  Bottom 0.254: U271.2 39.4,64.88 39.37,64.85 35.56,64.85 | 35.56,64.85 v35.56,67.31 | 35.56,64.85 v35.56,55.88 SV10.12
HWCON0
  Bottom 0.254: U272.19 48.63,66.31 48.9,66.04 48.9,60.33 49.53,59.69 SV7.1
HWCON1
  Bottom 0.254: U272.18 49.25,66.95 49.53,66.67 49.53,62.87 50.16,62.23 SV7.2
HWCON2
  Bottom 0.254: U272.17 49.87,67.61 50.16,67.31 50.16,64.77 SV7.3
HWCON3
  Bottom 0.254: U272.16 51.12,68.25 SV7.4
HWCON4
  Bottom 0.254: U272.15 51.12,68.91 SV7.5
HWCON5
  Bottom 0.254: U272.14 49.87,69.56 50.16,69.85 50.16,72.39 SV7.6
HWCON6
  Bottom 0.254: U272.13 49.25,70.2 49.53,70.48 49.53,74.93 SV7.7
HWCON7
  Bottom 0.254: U272.12 48.63,70.86 48.9,71.12 48.9,77.47 SV7.8
HWFLAG  (via drill 0.3 pad 0.51)
  Top 0.254: v36.2,55.24 38.73,55.24 40.01,56.52 53.98,56.52 J1.10R
  Bottom 0.254: SV10.10 36.83,50.8 36.83,52.7 36.2,53.34 v36.2,55.24 36.2,62.87 36.57,63.24 U111.9
HWFLAG0  (via drill 0.3 pad 0.51)
  Top 0.254: v43.18,41.91 SV6.1 | v26.67,68.58 J2.23 | v26.67,56.52 28.57,56.52 29.21,55.88 32.38,55.88 33.4,56.9 35.94,56.9 38.1,59.05 v39.37,59.05
  Bottom 0.254: SV6.1 R9.2 | U111.11 39.03,59.4 v39.37,59.05 40.26,59.05 40.89,59.69 41.53,59.69 43.18,58.04 v43.18,41.91 | v26.67,56.52 v26.67,68.58
HWFLAG1  (via drill 0.3 pad 0.51)
  Top 0.254: v43.81,39.37 SV6.3 | v26.04,67.31 J2.24 | v26.04,57.15 29.21,57.15 29.84,56.52 32,56.52 33.02,57.53 35.69,57.53 37.85,59.69 v39.88,59.69
  Bottom 0.254: SV6.3 R10.2 | v43.81,39.37 43.81,58.17 41.66,60.33 40.31,60.33 40.1,60.54 | v26.04,57.15 v26.04,67.31 | U111.12 39.68,60.96 40.1,60.54 | v39.88,59.69 39.88,60.33 40.1,60.54
HWFLAG2  (via drill 0.3 pad 0.51)
  Top 0.254: v44.45,36.83 SV6.5
  Bottom 0.254: SV6.5 R11.2 | v44.45,36.83 44.45,58.29 41.78,60.96 40.64,60.96 40.33,61.27 U111.13
HWFLAG3  (via drill 0.3 pad 0.51)
  Top 0.254: v45.09,35.56 48.9,35.56 SV6.7
  Bottom 0.254: R12.2 SV6.7 | v45.09,35.56 45.09,58.55 42.04,61.59 41.15,61.59 40.98,61.76 U111.14
HWFLAG4  (via drill 0.3 pad 0.51)
  Top 0.254: v41.27,34.29 48.26,34.29 49.53,33.02 49.53,32.38 SV6.9
  Bottom 0.254: SV6.9 R13.2 | U111.3 40.98,55.54 41.27,55.24 v41.27,34.29
HWFLAG5  (via drill 0.3 pad 0.51)
  Top 0.254: v40.64,33.66 47.62,33.66 48.9,32.38 48.9,30.48 SV6.11
  Bottom 0.254: R14.2 SV6.11 | U111.4 40.33,54.92 40.64,54.61 v40.64,33.66
HWFLAG6  (via drill 0.3 pad 0.51)
  Top 0.254: v40.01,33.02 46.99,33.02 48.26,31.75 48.26,28.57 SV6.13
  Bottom 0.254: R15.2 SV6.13 | U111.5 39.68,54.3 40.01,53.98 v40.01,33.02
HWFLAG7  (via drill 0.3 pad 0.51)
  Top 0.254: v39.37,32.38 46.35,32.38 47.62,31.11 47.62,26.67 SV6.15
  Bottom 0.254: R16.2 SV6.15 | U111.6 39.03,53.68 39.37,53.34 v39.37,32.38
LRCK
  Top 0.254: J1.11L 12.7,52.07 13.97,50.8 SV9.10 16.51,49.53 19.05,49.53 20.32,50.8 SV1.5 R3.1
MCLK  (via drill 0.3 pad 0.51)
  Top 0.254: U1.19 24.48,11.16 R18.2 22.69,14.14 22.23,14.61 v20.32,14.61 | v22.61,64.77 J2.26 | v20.95,39.37 SV10.2
  Bottom 0.254: v22.61,64.77 22.23,64.39 22.23,56.52 20.95,55.24 v20.95,39.37 20.95,29.84 20.32,29.21 v20.32,14.61
MCLKN  (via drill 0.3 pad 0.51)
  Top 0.254: 45.81,10.67 C3.2 47.24,10.41 49.53,12.7 58.42,12.7 v59.05,12.06
  Bottom 0.254: v59.05,12.06 60.33,13.34 60.33,22.23 58.67,23.88 58.67,33.4 57.78,34.29 J1.18R 57.15,34.29
MCLKP  (via drill 0.3 pad 0.51)
  Top 0.254: 45.81,8.13 C4.2 47.12,8.38 48.9,10.16 v58.42,10.16
  Bottom 0.254: v58.42,10.16 58.42,12.7 59.69,13.97 59.69,21.59 58.04,23.24 58.04,31.5 57.78,31.75 J1.19R
MISO  (via drill 0.3 pad 0.51)
  Top 0.254: v12.06,69.85 J2.22 J2.9
  Bottom 0.254: J1.19L 6.35,33.02 SV8.4 10.16,36.83 10.16,41.27 9.53,41.91 9.53,46.99 12.06,49.53 v12.06,69.85
MOSI  (via drill 0.3 pad 0.51)
  Top 0.254: J2.10 J2.21 v10.79,71.12 | J1.18L 7.62,34.29 SV8.2
  Bottom 0.254: J1.18L 6.35,34.29 7.62,35.56 7.62,41.27 8.26,41.91 8.26,48.26 10.79,50.8 v10.79,71.12
N$1
  Top 0.254: R17.2 40.81,8.38 | U1.2 40.28,9.16 R17.2 | R17.2 43.69,8.55 C4.1
N$2
  Bottom 0.254: U272.3 40.99,66.95 40.89,67.06 38.35,67.06 38.1,66.8 U271.4
N$3
  Bottom 0.254: U272.4 37.76,67.61 37.45,67.3 U271.5
N$4
  Bottom 0.254: U272.6 37.77,68.91 37.45,69.23 U271.10
N$5
  Bottom 0.254: U272.7 38.4,69.56 38.1,69.85 U271.11
N$6
  Bottom 0.254: U272.8 40.99,70.2 40.89,70.1 38.86,70.1 38.75,70.22 U271.12
N$7
  Bottom 0.254: U272.9 40.88,70.86 40.64,70.61 39.62,70.61 39.4,70.84 U271.13
N$10
  Bottom 0.813: R1.1 19.34,65.28 C2.1
N$11
  Top 0.254: U1.23 23.48,9.16 R20.2
N$13
  Top 1.016: C1.2 11.94,13.46 SV5.3
  Bottom 1.27: SV5.15 SV5.13 SV5.11 SV5.9 SV5.7 SV5.5 SV5.3 SV5.1
N$14
  Top 0.254: X1.1 13.34,10.03 C1.1 15.32,10.66 R8.2
N$15
  Top 0.254: U1.3 40.31,9.66 R17.1 43.69,10.25 C3.1
N$19
  Top 0.61: U8.1 30.86,21.72 30.48,21.34 28.07,21.34 C7.1
N$21
  Bottom 0.254: U272.2 40.88,66.31 40.64,66.55 38.99,66.55 38.75,66.31 U271.3
N$23
  Top 0.254: R18.1 19.05,12.95 16.51,15.49 X8.1
N$24
  Bottom 0.254: U272.5 37.14,68.25 36.8,67.92 U271.6
N$25
  Top 0.254: U1.22 23.44,9.66 R21.2
N$26
  Top 0.61: U8.3 33.4,20.95 35.56,18.8 36.9,18.8 C9.1
  Top 1.27: C9.1 39.33,18.86 C22.+
N$27
  Top 0.254: U1.32 35.27,8.16 35.81,7.62 35.81,3.81 34.96,2.96 R19.2
N$28
  Top 0.61: U8.6 U8.5 36.97,28.4 C8.1
N$29
  Top 0.254: R21.1 R20.1 20.07,7.45 20.07,6.35 20.15,6.18 R22.1 19.65,6.18
SCLK  (via drill 0.3 pad 0.51)
  Top 0.254: J2.11 J2.20 v20.32,72.39 | J1.13R 52.07,46.99 50.8,45.72 33.66,45.72 32.38,44.45 v20.32,44.45 | v20.32,38.1 13.97,38.1 12.7,36.83 10.16,36.83 SV8.6
  Bottom 0.254: v20.32,38.1 v20.32,44.45 20.32,55.88 18.41,57.78 18.41,62.87 20.32,64.77 v20.32,72.39
SRCLK  (via drill 0.3 pad 0.51)
  Top 0.254: v41.91,44.45 J1.14R | v41.91,48.26 36.83,48.26 SV10.8 | v36.2,68.58 J2.8 | v33.66,56.13 34.16,56.13 35.69,54.61 v41.91,54.61
  Bottom 0.254: v41.91,44.45 v41.91,48.26 v41.91,54.61 41.91,55.87 41.63,56.15 U111.2 | U271.8 36.15,68.62 v36.2,68.58 35.56,68.58 33.66,66.67 v33.66,56.13
SRCLK2  (via drill 0.3 pad 0.51)
  Top 0.254: J1.15R 54.61,43.18 v42.55,43.18 | v41.27,59.05 v48.26,59.05 | v42.55,40.01 41.27,40.01 40.64,40.64 36.83,40.64 SV10.4
  Bottom 0.254: v41.27,59.05 42.28,58.05 U111.1 42.28,56.78 42.55,56.52 v42.55,43.18 v42.55,40.01 | v48.26,59.05 45.72,61.59 45.72,70.48 46.74,71.5 U272.11
V1_D0  (via drill 0.3 pad 0.51)
  Top 0.254: R2.2 SV2.6 31.75,54.61 v33.66,54.61 | v34.29,74.93 J2.13
  Bottom 0.254: v34.29,74.93 33.02,73.66 33.02,55.88 33.66,55.24 v33.66,54.61
V1_D1  (via drill 0.3 pad 0.51)
  Top 0.254: R3.2 SV2.5 v33.02,50.8 | v34.29,76.2 J2.14
  Bottom 0.254: v34.29,76.2 32.38,74.3 32.38,55.24 33.02,54.61 v33.02,50.8
V1_D2  (via drill 0.3 pad 0.51)
  Top 0.254: R4.2 SV2.4 | v34.29,77.47 J2.15
  Bottom 0.254: v34.29,77.47 31.75,74.93 31.75,54.61 32.38,53.98 32.38,50.16 SV2.4
V1_D3  (via drill 0.3 pad 0.51)
  Top 0.254: R5.2 SV2.3 | v26.67,77.47 J2.16
  Bottom 0.254: v26.67,77.47 27.3,77.47 28.57,76.2 28.57,46.99 29.84,45.72 SV2.3
V1_D4  (via drill 0.3 pad 0.51)
  Top 0.254: R6.2 SV2.2 | v26.67,76.2 J2.17
  Bottom 0.254: v26.67,76.2 27.3,76.2 27.94,75.56 27.94,45.72 SV2.2
V1_D5  (via drill 0.3 pad 0.51)
  Top 0.254: R7.2 SV2.1 | v26.67,74.93 J2.18
  Bottom 0.254: v26.67,74.93 26.92,74.93 27.3,74.55 27.3,43.18 29.84,40.64 SV2.1